# EAGLE schematic czujnik (EAGLE 8.4.0)
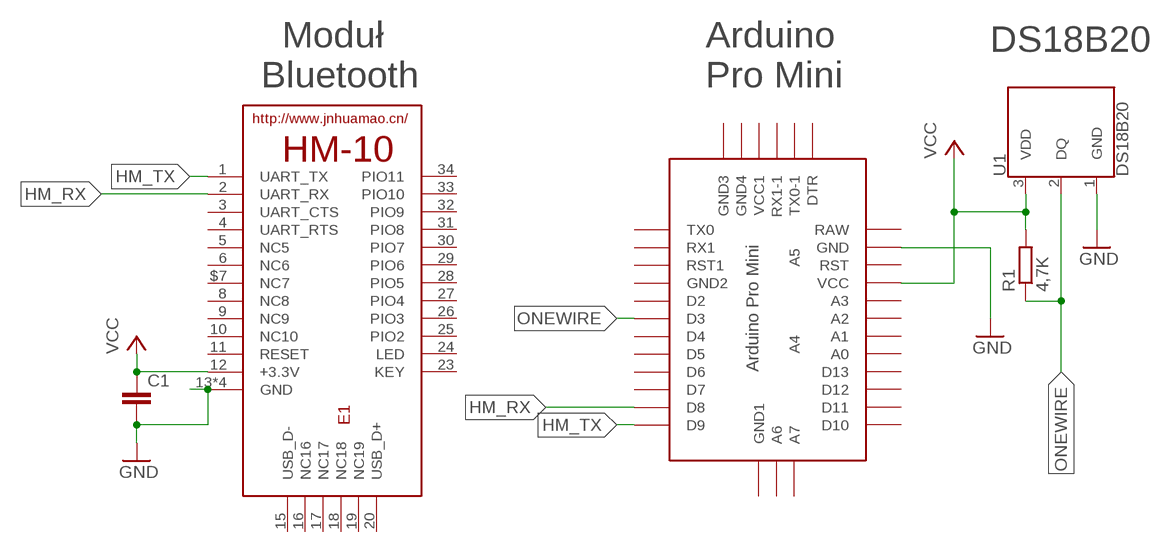
[diagram p0: schematic, sheet 1]

## Parts
C1  C-EU025-024X044  [C025-024X044]
E1  HM-10-BOARD  [26.9X13X2.2_BOARD]
R1  4,7K  R-EU_0204/5  [0204/5]
U1  DS18B20  [TO-92-AMMO]
U$1  ABK-PRO-MINI  [ABK-PRO-MINI]

## Nets
GND: C1.2 E1.13(GND) E1.14(GND) E1.21(GND) E1.22(GND) U1.1(GND) U$1.GND
HM_RX: E1.2(UART_RX) U$1.D8
HM_TX: E1.1(UART_TX) U$1.D9
N$1: R1.2 U1.3(VDD) U$1.VCC ; supply symbol labelled VCC
ONEWIRE: R1.1 U1.2(DQ) U$1.D3
VCC: C1.1 E1.12(+3.3V)
Unconnected: E1.3(UART_CTS) E1.4(UART_RTS) E1.5(NC5) E1.6(NC6) E1.8(NC8) E1.9(NC9) E1.10(NC10) E1.11(RESET) E1.15(USB_D-) E1.16(NC16) E1.17(NC17) E1.18(NC18) E1.19(NC19) E1.20(USB_D+) E1.23(KEY) E1.24(LED) E1.25(PIO2) E1.26(PIO3) E1.27(PIO4) E1.28(PIO5) E1.29(PIO6) E1.30(PIO7) E1.31(PIO8) E1.32(PIO9) E1.33(PIO10) E1.34(PIO11) E1.$7(NC7) U$1.A0 U$1.A1 U$1.A2 U$1.A3 U$1.A4 U$1.A5 U$1.A6 U$1.A7 U$1.D2 U$1.D4 U$1.D5 U$1.D6 U$1.D7 U$1.D10 U$1.D11 U$1.D12 U$1.D13 U$1.DTR U$1.GND1(GND2) U$1.GND2(GND3) U$1.GND3(GND4) U$1.GND4(GND1) U$1.RAW U$1.RST U$1.RST1 U$1.RX1 U$1.RX1-1 U$1.TX0 U$1.TX0-1 U$1.VCC1

## Notes on the sheet
- DS18B20
- Moduł 
  Bluetooth
- Arduino
  Pro Mini

## Library data of the parts
C1 = rcl:C-EU: CAPACITOR, European symbol
E1 = JNHuaMao:HM-10: HM Bluetooth module use TI CC2540 or CC2541, Master and slave roles in one, transmission version and remote control version and PIO state acquisition functions in one, Support the AT command modify module parameters, Convenient and flexible.
R1 = rcl:R-EU_: RESISTOR, European symbol
U1 = SparkFun-Sensors:DS18B20: Dallas/Maxim DS18B20 1-Wire Temperature Sensor The DS18B20 reports degrees C with 9 to 12-bit precision, -55C to 125C (+/-0.5C). Each sensor has a unique 64-Bit Serial number etched into it - allows for a huge number of sensors to be used on one data bus. Datasheet <http://datasheets.maximintegrated.com/en/ds/DS18B20.pdf> SparkFun Products One Wire Digital Temperature Sensor - DS18B20 <https://www.sparkfun.com/products/245> (SEN-00245); STORE_ID: SEN-00245
U$1 = Arduino-clone:ABK-PRO-MINI: ABK Pro-Mini Arduino Clone